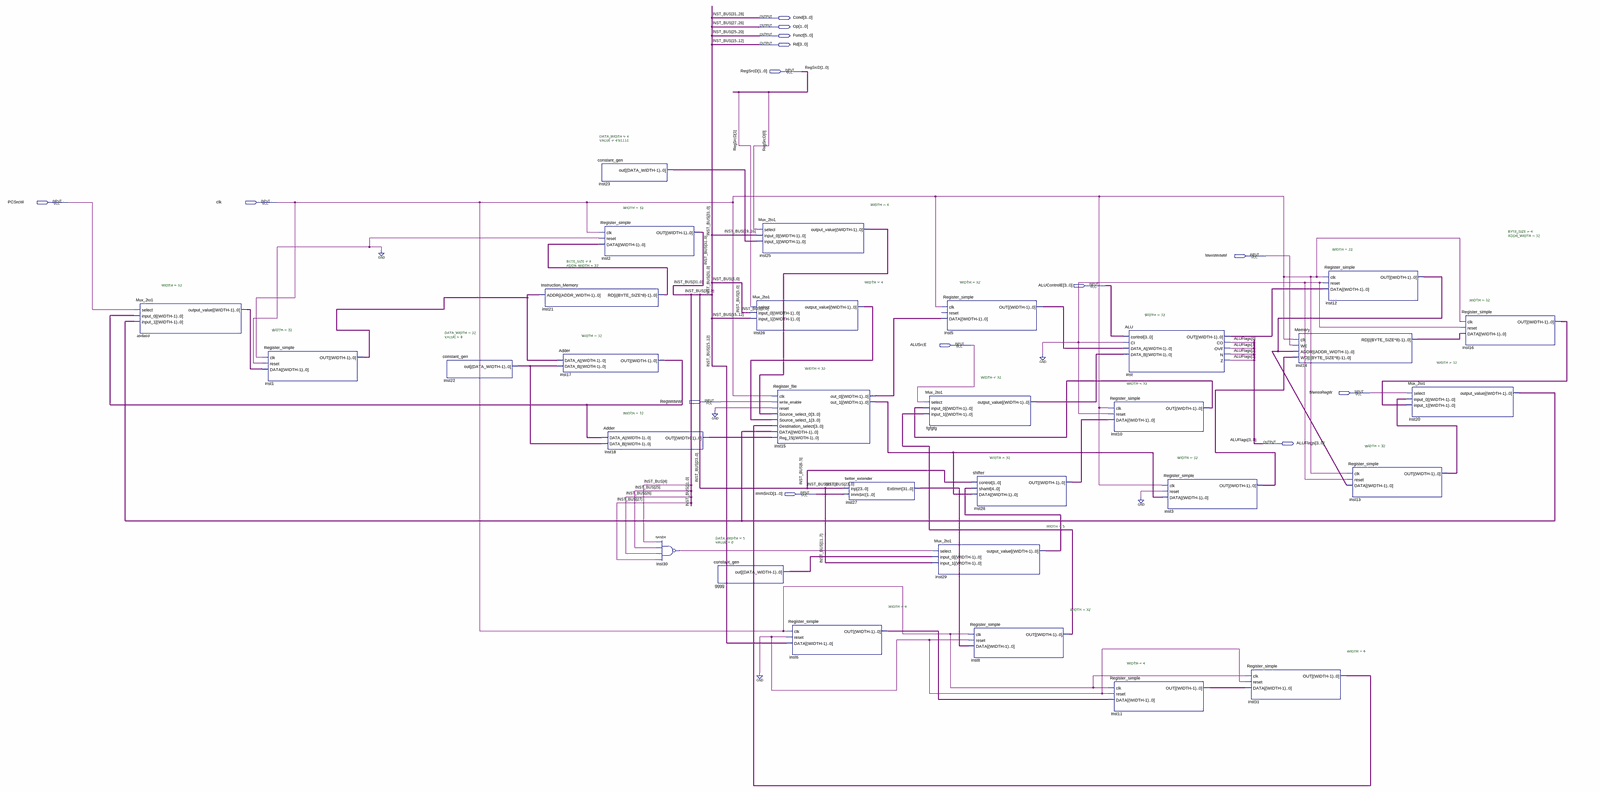
[diagram p0: schematic sheet, whole]
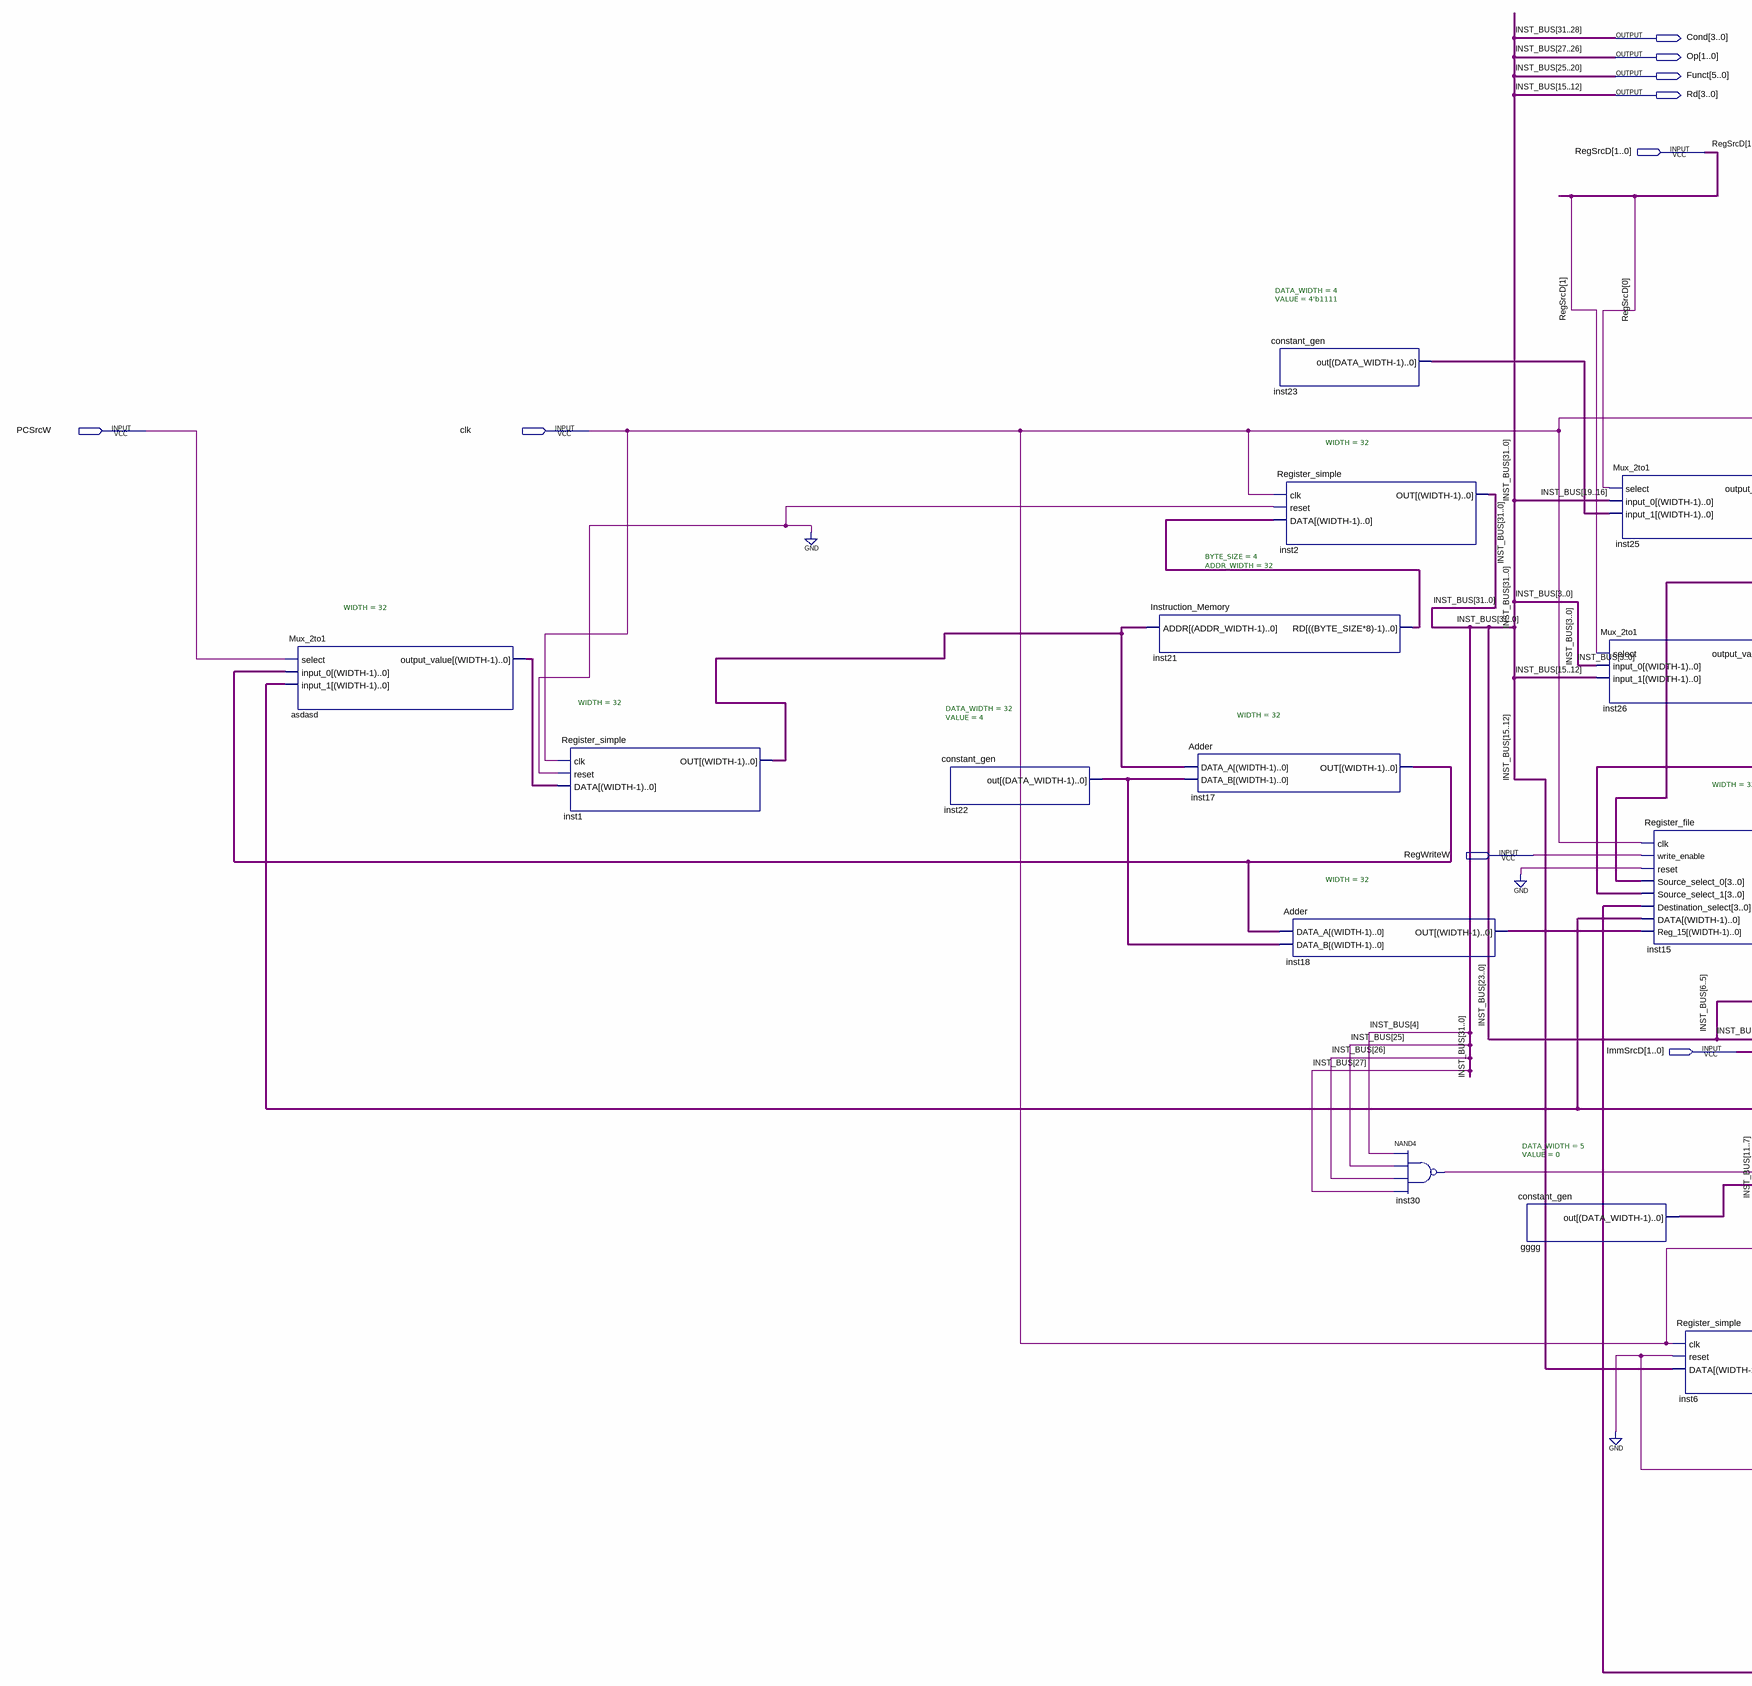
[diagram p1: schematic sheet, left part]
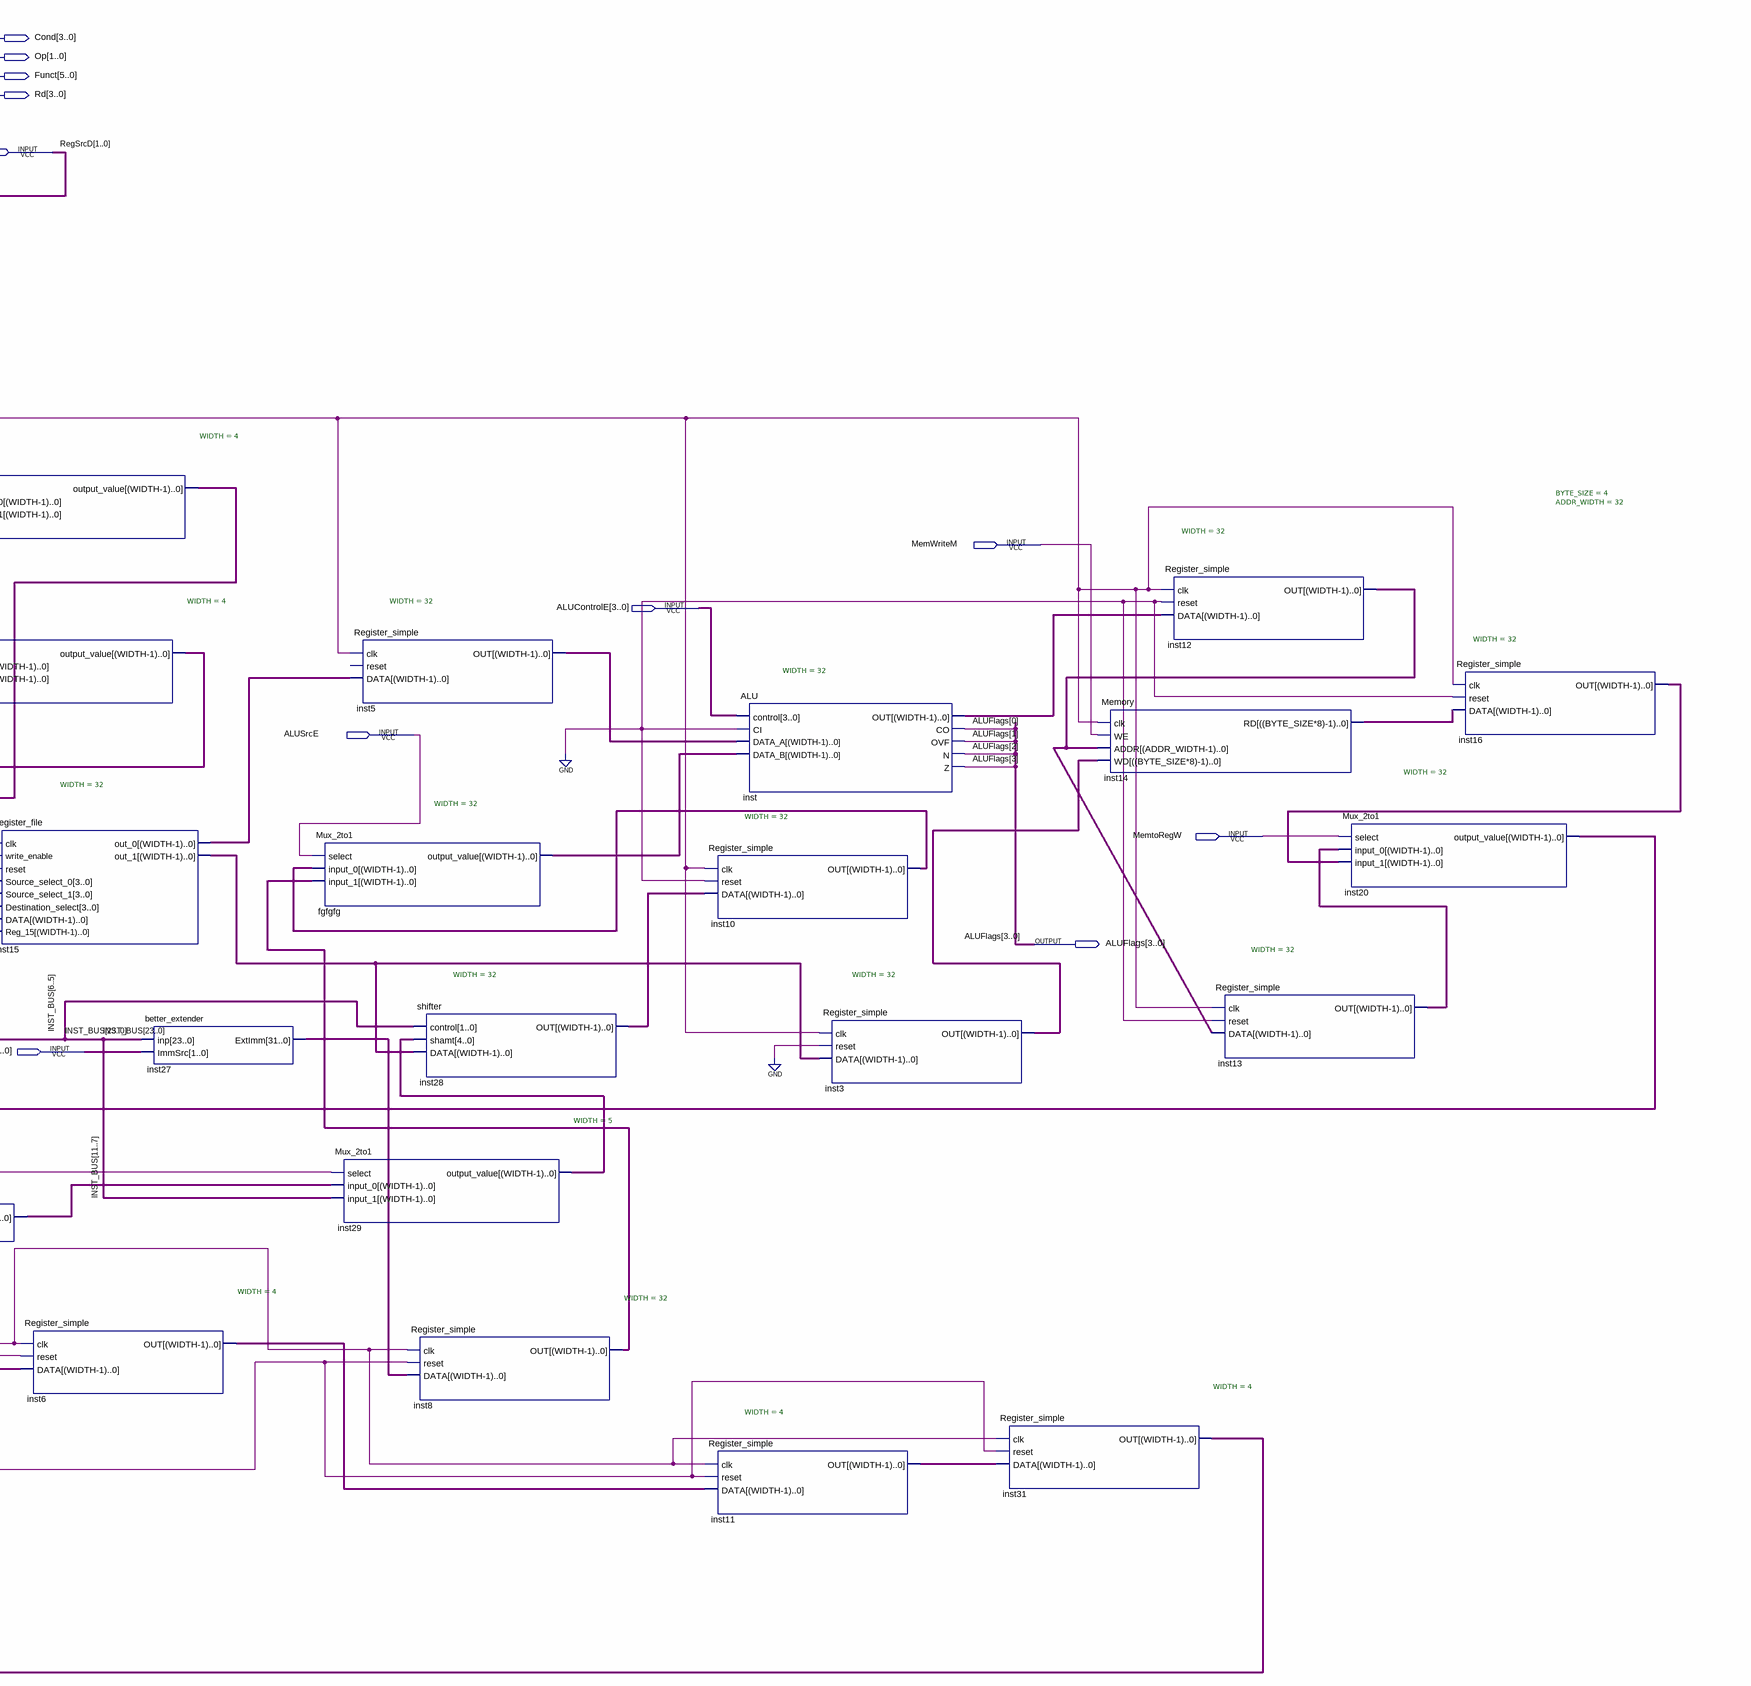
[diagram p2: schematic sheet, right part]
// Quartus schematic datapath.bdf as structural Verilog: 30 symbols, 14 pins
module datapath (
  input  [1:0] RegSrcD,
  input  PCSrcW,
  input  clk,
  input  MemWriteM,
  input  [3:0] ALUControlE,
  input  ALUSrcE,
  input  MemtoRegW,
  input  RegWriteW,
  input  [1:0] ImmSrcD,
  output [3:0] Cond,
  output [1:0] Op,
  output [5:0] Funct,
  output [3:0] Rd,
  output [3:0] ALUFlags
);

  wire inst30_out;
  wire [3:0] inst6_out, inst11_out, inst23_out, inst25_output_value, inst26_output_value, inst31_out;
  wire [4:0] gggg_out, inst29_output_value;
  wire [19:0] INST_BUS;
  wire [31:0] asdasd_output_value, fgfgfg_output_value, inst1_out, inst3_out, inst5_out, inst8_out,
       inst10_out, inst12_out, inst13_out, inst14_rd, inst15_out_0, inst15_out_1, inst16_out, inst17_out,
       inst18_out, inst20_output_value, inst21_rd, inst22_out, inst27_extimm, inst28_out, inst_out;

  Mux_2to1 #(.WIDTH(32)) asdasd (
    .select(PCSrcW), .input_0(inst17_out), .input_1(inst20_output_value), .output_value(asdasd_output_value));
  Register_simple #(.WIDTH(32)) inst1 (.clk(clk), .reset(1'b0), .DATA(asdasd_output_value), .OUT(inst1_out));
  constant_gen #(.DATA_WIDTH(32), .VALUE(4)) inst22 (.out(inst22_out));
  Instruction_Memory #(.BYTE_SIZE(4), .ADDR_WIDTH(32)) inst21 (.ADDR(inst1_out), .RD(inst21_rd));
  Adder #(.WIDTH(32)) inst17 (.DATA_A(inst1_out), .DATA_B(inst22_out), .OUT(inst17_out));
  constant_gen #(.DATA_WIDTH(4), .VALUE(4'b1111)) inst23 (.out(inst23_out));
  Register_simple #(.WIDTH(32)) inst2 (
    .clk(clk), .reset(1'b0), .DATA(inst21_rd), .OUT({Cond, Op, Funct, INST_BUS[19:16], Rd, INST_BUS[11:0]}));
  Adder #(.WIDTH(32)) inst18 (.DATA_A(inst17_out), .DATA_B(inst22_out), .OUT(inst18_out));
  nand inst30 (inst30_out, INST_BUS[4], Funct[5], Op[0], Op[1]);
  constant_gen #(.DATA_WIDTH(5), .VALUE(0)) gggg (.out(gggg_out));
  Mux_2to1 #(.WIDTH(4)) inst25 (
    .select(RegSrcD[0]), .input_0(INST_BUS[19:16]), .input_1(inst23_out), .output_value(inst25_output_value));
  Mux_2to1 #(.WIDTH(4)) inst26 (
    .select(RegSrcD[1]), .input_0(INST_BUS[3:0]), .input_1(Rd), .output_value(inst26_output_value));
  Register_file #(.WIDTH(32)) inst15 (
    .clk(clk), .write_enable(RegWriteW), .reset(1'b0), .Source_select_0(inst25_output_value),
    .Source_select_1(inst26_output_value), .Destination_select(inst31_out), .DATA(inst20_output_value),
    .Reg_15(inst18_out), .out_0(inst15_out_0), .out_1(inst15_out_1));
  Register_simple #(.WIDTH(4)) inst6 (.clk(clk), .reset(1'b0), .DATA(Rd), .OUT(inst6_out));
  better_extender inst27 (
    .inp({Funct[3:0], INST_BUS[19:16], Rd, INST_BUS[11:0]}), .ImmSrc(ImmSrcD), .ExtImm(inst27_extimm));
  Mux_2to1 #(.WIDTH(32)) fgfgfg (
    .select(ALUSrcE), .input_0(inst10_out), .input_1(inst8_out), .output_value(fgfgfg_output_value));
  Mux_2to1 #(.WIDTH(5)) inst29 (
    .select(inst30_out), .input_0(gggg_out), .input_1(INST_BUS[11:7]), .output_value(inst29_output_value));
  Register_simple #(.WIDTH(32)) inst5 (.clk(clk), .DATA(inst15_out_0), .OUT(inst5_out));  // open: reset
  shifter #(.WIDTH(32)) inst28 (
    .control(INST_BUS[6:5]), .shamt(inst29_output_value), .DATA(inst15_out_1), .OUT(inst28_out));
  Register_simple #(.WIDTH(32)) inst8 (.clk(clk), .reset(1'b0), .DATA(inst27_extimm), .OUT(inst8_out));
  ALU #(.WIDTH(32)) inst (
    .control(ALUControlE), .CI(1'b0), .DATA_A(inst5_out), .DATA_B(fgfgfg_output_value), .OUT(inst_out),
    .CO(ALUFlags[0]), .OVF(ALUFlags[1]), .N(ALUFlags[2]), .Z(ALUFlags[3]));
  Register_simple #(.WIDTH(32)) inst10 (.clk(clk), .reset(1'b0), .DATA(inst28_out), .OUT(inst10_out));
  Register_simple #(.WIDTH(4)) inst11 (.clk(clk), .reset(1'b0), .DATA(inst6_out), .OUT(inst11_out));
  Register_simple #(.WIDTH(32)) inst3 (.clk(clk), .reset(1'b0), .DATA(inst15_out_1), .OUT(inst3_out));
  Register_simple #(.WIDTH(4)) inst31 (.clk(clk), .reset(1'b0), .DATA(inst11_out), .OUT(inst31_out));
  Memory #(.BYTE_SIZE(4), .ADDR_WIDTH(32)) inst14 (
    .clk(clk), .WE(MemWriteM), .ADDR(inst12_out), .WD(inst3_out), .RD(inst14_rd));
  Register_simple #(.WIDTH(32)) inst12 (.clk(clk), .reset(1'b0), .DATA(inst_out), .OUT(inst12_out));
  Register_simple #(.WIDTH(32)) inst13 (.clk(clk), .reset(1'b0), .DATA(inst12_out), .OUT(inst13_out));
  Mux_2to1 #(.WIDTH(32)) inst20 (
    .select(MemtoRegW), .input_0(inst13_out), .input_1(inst16_out), .output_value(inst20_output_value));
  Register_simple #(.WIDTH(32)) inst16 (.clk(clk), .reset(1'b0), .DATA(inst14_rd), .OUT(inst16_out));

  // Other names for the same wires on the sheet: INST_BUS (some bits) = {Cond, Op, Funct, Rd}
endmodule
